# EAGLE design SuperFuzzWah_v1.0 (EAGLE 6.3)
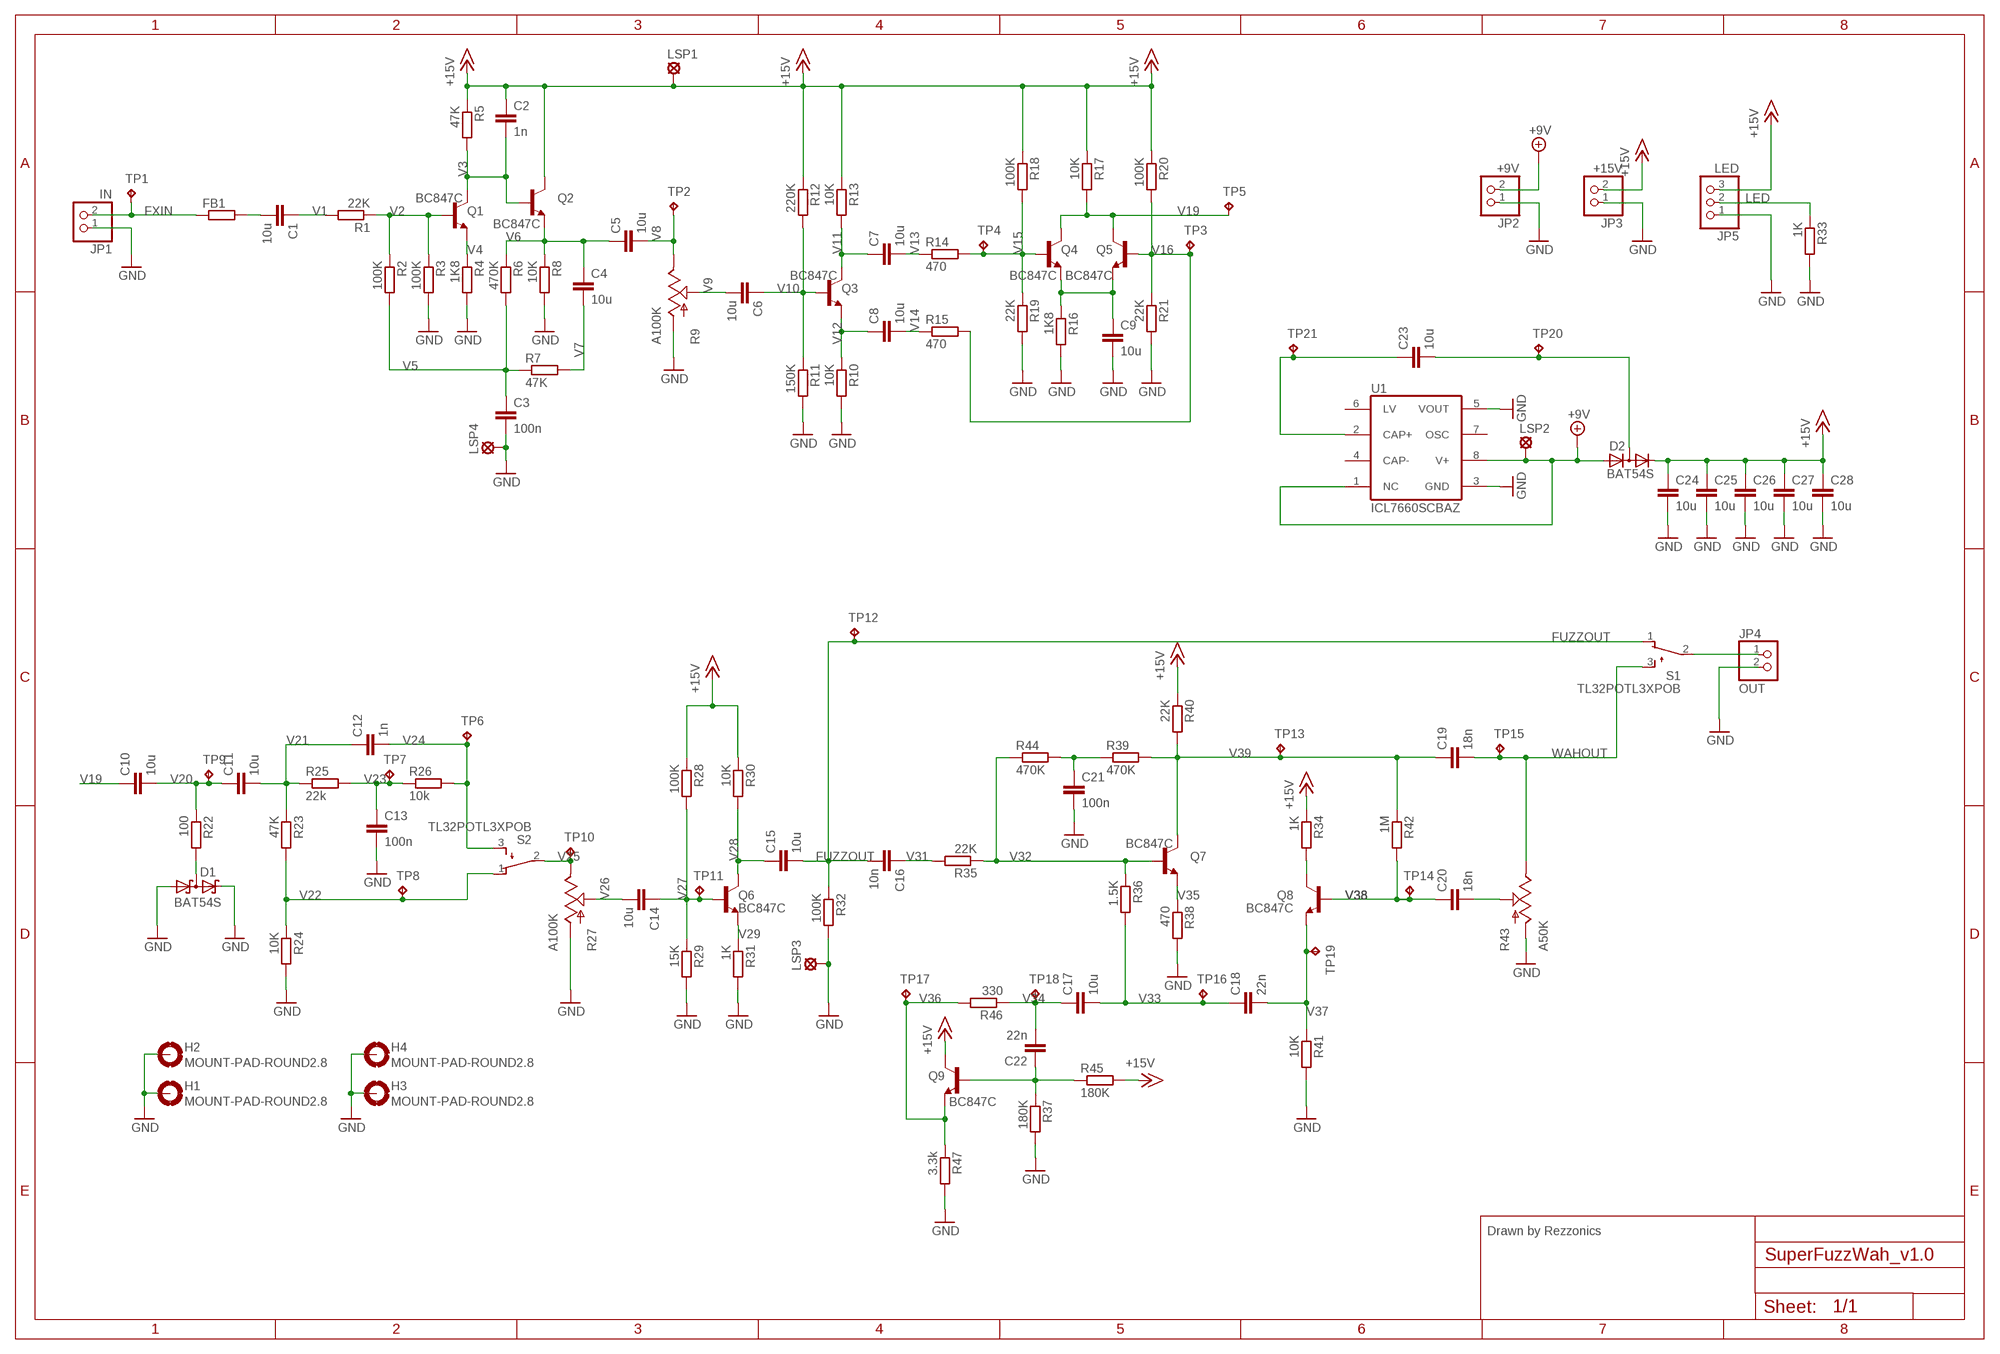
[diagram p0: schematic, sheet 1]

## Parts
C1  10u  C-EUC0805K  [C0805K]
C2  1n  C-EUC0805K  [C0805K]
C3  100n  C-EUC1210K  [C1210K]
C4  10u  C-EUC0805K  [C0805K]
C5  10u  C-EUC0805K  [C0805K]
C6  10u  C-EUC0805K  [C0805K]
C7  10u  C-EUC0805K  [C0805K]
C8  10u  C-EUC0805K  [C0805K]
C9  10u  C-EUC0805K  [C0805K]
C10  10u  C-EUC0805K  [C0805K]
C11  10u  C-EUC0805K  [C0805K]
C12  1n  C-EUC0805K  [C0805K]
C13  100n  C-EUC1210K  [C1210K]
C14  10u  C-EUC0805K  [C0805K]
C15  10u  C-EUC0805K  [C0805K]
C16  10n  C-EUC0603K  [C0603K]
C17  10u  C-EUC0805K  [C0805K]
C18  22n  C-EUC1210K  [C1210K]
C19  18n  C-EUC1210K  [C1210K]
C20  18n  C-EUC1210K  [C1210K]
C21  100n  C-EUC1210K  [C1210K]
C22  22n  C-EUC1210K  [C1210K]
C23  10u  C-EUC0805K  [C0805K]
C24  10u  C-EUC0805K  [C0805K]
C25  10u  C-EUC0805K  [C0805K]
C26  10u  C-EUC0805K  [C0805K]
C27  10u  C-EUC0805K  [C0805K]
C28  10u  C-EUC0805K  [C0805K]
D1  BAT54S  [SOT23]
D2  BAT54S  DIODE_2CACA-SOT23  [SOT23]
FB1  R-EU_R1206  [R1206]
H1  MOUNT-PAD-ROUND2.8  [2,8-PAD]
H2  MOUNT-PAD-ROUND2.8  [2,8-PAD]
H3  MOUNT-PAD-ROUND2.8  [2,8-PAD]
H4  MOUNT-PAD-ROUND2.8  [2,8-PAD]
JP1  IN  PINHD-1X2  [1X02]
JP2  +9V  PINHD-1X2  [1X02]
JP3  +15V  PINHD-1X2  [1X02]
JP4  OUT  PINHD-1X2  [1X02]
JP5  LED  PINHD-1X3  [1X03]
LSP1  LSP13  [LSP13]
LSP2  LSP13  [LSP13]
LSP3  LSP13  [LSP13]
LSP4  LSP13  [LSP13]
Q1  BC847C  BC847C-NPN-SOT23-BEC  [SOT23-BEC]
Q2  BC847C  BC847C-NPN-SOT23-BEC  [SOT23-BEC]
Q3  BC847C  BC847C-NPN-SOT23-BEC  [SOT23-BEC]
Q4  BC847C  BC847C-NPN-SOT23-BEC  [SOT23-BEC]
Q5  BC847C  BC847C-NPN-SOT23-BEC  [SOT23-BEC]
Q6  BC847C  BC847C-NPN-SOT23-BEC  [SOT23-BEC]
Q7  BC847C  BC847C-NPN-SOT23-BEC  [SOT23-BEC]
Q8  BC847C  BC847C-NPN-SOT23-BEC  [SOT23-BEC]
Q9  BC847C  BC847C-NPN-SOT23-BEC  [SOT23-BEC]
R1  22K  R-EU_R0603  [R0603]
R2  100K  R-EU_R0603  [R0603]
R3  100K  R-EU_R0603  [R0603]
R4  1K8  R-EU_R0603  [R0603]
R5  47K  R-EU_R0603  [R0603]
R6  470K  R-EU_R0603  [R0603]
R7  47K  R-EU_R0603  [R0603]
R8  10K  R-EU_R0603  [R0603]
R9  A100K  POT-RV16AF-20  [POT_ALPHA_RV16AF-20]
R10  10K  R-EU_R0603  [R0603]
R11  150K  R-EU_R0603  [R0603]
R12  220K  R-EU_R0603  [R0603]
R13  10K  R-EU_R0603  [R0603]
R14  470  R-EU_R0603  [R0603]
R15  470  R-EU_R0603  [R0603]
R16  1K8  R-EU_R0603  [R0603]
R17  10K  R-EU_R0603  [R0603]
R18  100K  R-EU_R0603  [R0603]
R19  22K  R-EU_R0603  [R0603]
R20  100K  R-EU_R0603  [R0603]
R21  22K  R-EU_R0603  [R0603]
R22  100  R-EU_R0603  [R0603]
R23  47K  R-EU_R0603  [R0603]
R24  10K  R-EU_R0603  [R0603]
R25  22k  R-EU_R0603  [R0603]
R26  10k  R-EU_R0603  [R0603]
R27  A100K  POT-RV16AF-20  [POT_ALPHA_RV16AF-20]
R28  100K  R-EU_R0603  [R0603]
R29  15K  R-EU_R0603  [R0603]
R30  10K  R-EU_R0603  [R0603]
R31  1K  R-EU_R0603  [R0603]
R32  100K  R-EU_R0603  [R0603]
R33  1K  R-EU_R0603  [R0603]
R34  1K  R-EU_R0603  [R0603]
R35  22K  R-EU_R0603  [R0603]
R36  1.5K  R-EU_R0603  [R0603]
R37  180K  R-EU_R0603  [R0603]
R38  470  R-EU_R0603  [R0603]
R39  470K  R-EU_R0603  [R0603]
R40  22K  R-EU_R0603  [R0603]
R41  10K  R-EU_R0603  [R0603]
R42  1M  R-EU_R0603  [R0603]
R43  A50K  POT-RV16AF-20  [POT_ALPHA_RV16AF-20]
R44  470K  R-EU_R0603  [R0603]
R45  180K  R-EU_R0603  [R0603]
R46  330  R-EU_R0603  [R0603]
R47  3.3k  R-EU_R0603  [R0603]
S1  TL32POTL3XPOB  [TL3XPOB]
S2  TL32POTL3XPOB  [TL3XPOB]
TP1  TPTP10R  [TP10R]
TP2  TPTP10R  [TP10R]
TP3  TPTP10R  [TP10R]
TP4  TPTP10R  [TP10R]
TP5  TPTP10R  [TP10R]
TP6  TPTP10R  [TP10R]
TP7  TPTP10R  [TP10R]
TP8  TPTP10R  [TP10R]
TP9  TPTP10R  [TP10R]
TP10  TPTP10R  [TP10R]
TP11  TPTP10R  [TP10R]
TP12  TPTP10R  [TP10R]
TP13  TPTP10R  [TP10R]
TP14  TPTP10R  [TP10R]
TP15  TPTP10R  [TP10R]
TP16  TPTP10R  [TP10R]
TP17  TPTP10R  [TP10R]
TP18  TPTP10R  [TP10R]
TP19  TPTP10R  [TP10R]
TP20  TPTP10R  [TP10R]
TP21  TPTP10R  [TP10R]
U1  ICL7660SCBAZ  ICL7660CSA  [SO08]

## Nets
+9V: D2.1(A) JP2.2 LSP2.MP U1.1(NC) U1.8(V+)
+15V: C2.1 C24.1 C25.1 C26.1 C27.1 C28.1 D2.2(C) JP3.2 JP5.3 LSP1.MP Q2.C Q9.C R5.1 R12.1 R13.1 R17.1 R18.1 R20.1 R28.1 R30.1 R34.1 R40.1 R45.2
FUZZOUT: C15.2 C16.2 R32.1 S1.1(O) TP12.TP
FXIN: FB1.1 JP1.2 TP1.TP
GND: C3.2 C9.2 C13.2 C21.2 C24.2 C25.2 C26.2 C27.2 C28.2 D1.1(A1) D1.2(C2) H1.B2,8(MOUNT) H2.B2,8(MOUNT) H3.B2,8(MOUNT) H4.B2,8(MOUNT) JP1.1 JP2.1 JP3.1 JP4.2 JP5.1 LSP3.MP LSP4.MP R3.2 R4.2 R8.2 R9.1(A) R10.2 R11.2 R16.2 R19.2 R21.2 R24.2 R27.1(A) R29.2 R31.2 R32.2 R33.2 R37.2 R38.2 R41.2 R43.1(A) R47.2 U1.3(GND) U1.5(VOUT)
LED: JP5.2 R33.1
N$1: D1.3(C1A2) R22.2
N$2: C20.2 R43.2(S)
N$3: C21.1 R39.1 R44.2
N$4: Q8.C R34.2
N$5: JP4.1 S1.2(P)
N$6: C22.1 Q9.B R37.1 R45.1
N$7: C1.2 FB1.2
N$8: C23.1 TP21.TP U1.2(CAP+)
N$10: C23.2 D2.3(AC) TP20.TP
N$19: C9.1 Q4.E Q5.E R16.1
V1: C1.1 R1.2
V2: Q1.B R1.1 R2.1 R3.1
V3: C2.2 Q1.C Q2.B R5.2
V4: Q1.E R4.1
V5: C3.1 R2.2 R6.2 R7.1
V6: C4.1 C5.1 Q2.E R6.1 R8.1
V7: C4.2 R7.2
V8: C5.2 R9.3(E) TP2.TP
V9: C6.2 R9.2(S)
V10: C6.1 Q3.B R11.1 R12.2
V11: C7.1 Q3.C R13.2
V12: C8.1 Q3.E R10.1
V13: C7.2 R14.1
V14: C8.2 R15.1
V15: Q4.B R14.2 R18.2 R19.1 TP4.TP
V16: Q5.B R15.2 R20.2 R21.1 TP3.TP
V19: C10.1 Q4.C Q5.C R17.2 TP5.TP
V20: C10.2 C11.1 R22.1 TP9.TP
V21: C11.2 C12.1 R23.1 R25.1
V22: R23.2 R24.1 S2.1(O) TP8.TP
V23: C13.1 R25.2 R26.1 TP7.TP
V24: C12.2 R26.2 S2.3(S) TP6.TP
V25: R27.3(E) S2.2(P) TP10.TP
V26: C14.2 R27.2(S)
V27: C14.1 Q6.B R28.2 R29.1 TP11.TP
V28: C15.1 Q6.C R30.2
V29: Q6.E R31.1
V31: C16.1 R35.2
V32: Q7.B R35.1 R36.1 R44.1
V33: C17.2 C18.1 R36.2 TP16.TP
V34: C17.1 C22.2 R46.1 TP18.TP
V35: Q7.E R38.1
V36: Q9.E R46.2 R47.1 TP17.TP
V37: C18.2 Q8.E R41.1 TP19.TP
V38: C20.1 Q8.B R42.2 TP14.TP
V39: C19.1 Q7.C R39.2 R40.2 R42.1 TP13.TP
WAHOUT: C19.2 R43.3(E) S1.3(S) TP15.TP
Unconnected: U1.4(CAP-) U1.6(LV) U1.7(OSC)

## Notes on the sheet
- Drawn by Rezzonics

## Library data of the parts
C1 C4-C11 C14 C15 C17 C23-C28 = rcl:C-EU: CAPACITOR, European symbol; MPN: GRM21BR61E106KA73L
C2 C12 = rcl:C-EU: CAPACITOR, European symbol; MPN: GRM1885C1H102FA01D
C3 C13 C21 = rcl:C-EU: CAPACITOR, European symbol; MPN: CB027D0104JBA
C16 = rcl:C-EU: CAPACITOR, European symbol; MPN: ESD35C103K4T2A-18
C18 C22 = rcl:C-EU: CAPACITOR, European symbol; MPN: ECH-U1H223JX5
C19 C20 = rcl:C-EU: CAPACITOR, European symbol; MPN: ECH-U1H183GX5
D1 = diode:BAT54S: Schottky Diodes Pin connection corrected 2011-05-04 Source: Fairchild .. BAT54.pdf; MPN: BAT54S
D2 = diode:DIODE_2CACA-: 2 Diodes - Cathode-Anode|Cathode-Anode; MPN: BAT54S
FB1 = rcl:R-EU_: RESISTOR, European symbol; MPN: BLM31PG121SN1L
H1-H4 = holes:MOUNT-PAD-ROUND: MOUNTING PAD, round; MPN: *
JP1-JP4 = pinhead:PINHD-1X2: PIN HEADER; MPN: 77311-401-36LF
JP5 = pinhead:PINHD-1X3: PIN HEADER; MPN: 77311-401-36LF
LSP1-LSP4 = solpad:LSP13: SOLDER PAD drill 1.3 mm, distributor Buerklin, 12H562; MPN: 1249
Q1-Q9 = transistor-neu-to92:*-NPN-: NPN Transistror; MPN: BC847C,215
R1 R19 R21 R25 R35 R40 = resistor:R-EU_: RESISTOR, European symbol; MPN: ERJ-3EKF2202V
R2 R3 R18 R20 R28 R32 = resistor:R-EU_: RESISTOR, European symbol; MPN: CR0603-FX-1003ELF
R4 R16 = resistor:R-EU_: RESISTOR, European symbol; MPN: ERJ-3EKF1801V
R5 R7 R23 = resistor:R-EU_: RESISTOR, European symbol; MPN: RK73H1JTTD4702F
R6 R39 R44 = resistor:R-EU_: RESISTOR, European symbol; MPN: ERJ-3EKF4703V
R8 R10 R13 R17 R24 R26 R30 R41 = resistor:R-EU_: RESISTOR, European symbol; MPN: CR0603-FX-1002HLF
R9 R27 = SparkFun:POT; MPN: RV16AF-10-20R1-A100K
R11 = resistor:R-EU_: RESISTOR, European symbol; MPN: CRCW0603150KFKEB
R12 = resistor:R-EU_: RESISTOR, European symbol; MPN: ERJ-3EKF2203V
R14 R15 R38 = resistor:R-EU_: RESISTOR, European symbol; MPN: CR0603-FX-4700ELF
R22 = resistor:R-EU_: RESISTOR, European symbol; MPN: CR0201-FW-1000GLF
R29 = resistor:R-EU_: RESISTOR, European symbol; MPN: RK73H1HTTC1502F
R31 R33 R34 = resistor:R-EU_: RESISTOR, European symbol; MPN: CR0603-FX-1001HLF
R36 = resistor:R-EU_: RESISTOR, European symbol; MPN: ERJ-3EKF1501V
R37 R45 = resistor:R-EU_: RESISTOR, European symbol; MPN: CR0603-FX-1803ELF
R42 = resistor:R-EU_: RESISTOR, European symbol; MPN: CR0603-FX-1004ELF
R43 = SparkFun:POT; MPN: RV16AF-10-20R1-A50K
R46 = resistor:R-EU_: RESISTOR, European symbol; MPN: ERJ-3EKF3300V
R47 = resistor:R-EU_: RESISTOR, European symbol; MPN: RK73H1JTTDD3321F
S1 S2 = switch:TL32PO: TINY SWITCH ON - MOM Source: http://www2.produktinfo.conrad.com/datenblaetter/700000-724999/705152-da-01-de-Subminiaturschalter_TL_36YO.pdf; MPN: M2012SS1W01
TP1-TP21 = testpad:TP: Test pad; MPN: *
U1 = maxim:ICL7660CSA: VOLTAGE CONVERTER; MF: MAXIM; MPN: ICL7660SCBAZ; OC_FARNELL: 9724710; OC_NEWARK: 34C3732

## Board
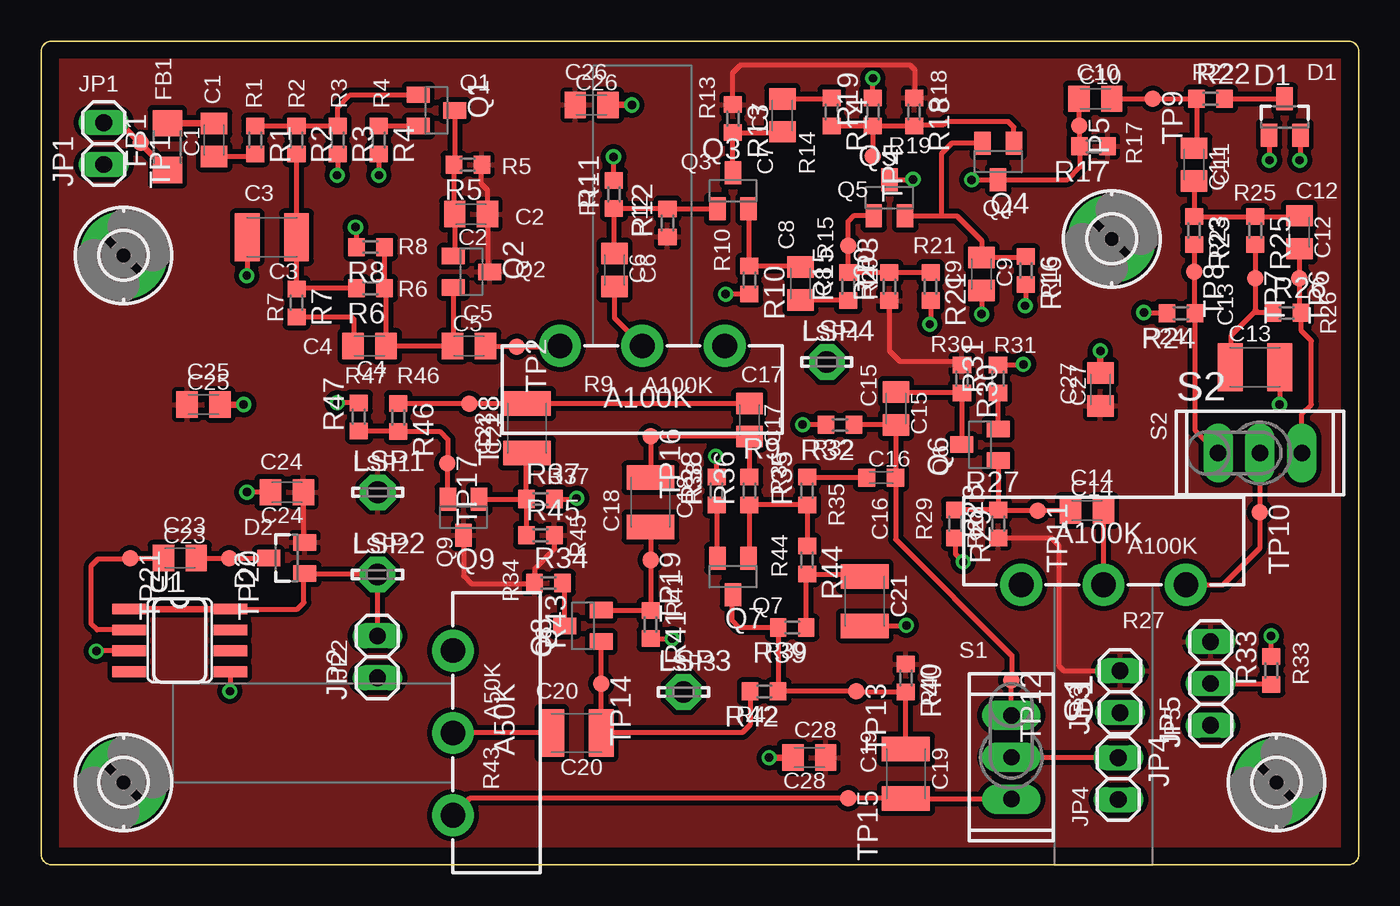
[diagram p1: board, top side]
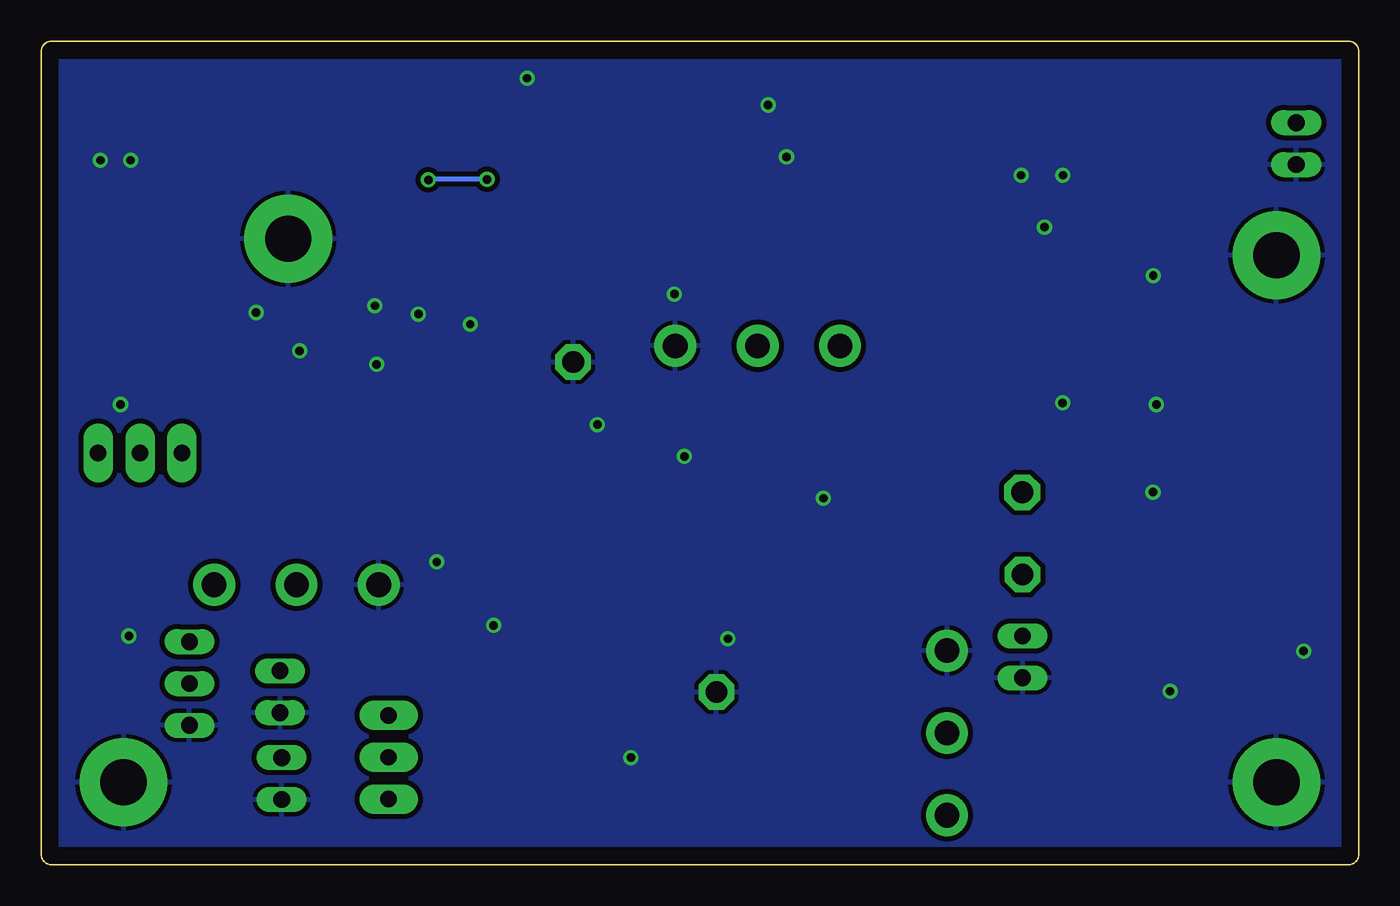
[diagram p2: board, bottom side, seen from below]

Size 80 x 50 mm. Coordinates in mm from the lower left corner, seen from the top.
Outline: 0,49.37 0,0.64 arc90 0.64,0 79.36,0 arc90 80,0.64 80,49.37 arc90 79.36,50 0.64,50 arc90 0,49.37
Copper layers (1*16): Top 0.035mm / dielectric 1.5mm / Bottom 0.035mm
Design rules "default *": minimum track width 10mil, minimum drill 19mil, track to track 8mil, track to pad 8mil, pad to pad 8mil, via to via 8mil, smd to smd 8mil, copper to edge 40mil, drill to drill 8mil, minimum pad ring 10mil, minimum via ring 8mil, stop-mask expansion 4mil, vias tented up to drill 0mil, thermal gap 10mil

### Footprints (pad centres in the part's own frame; a part is rotated, then mirrored left to right if it is on the bottom)
C0805K = smd 1.3 x 1.6: 1 -1,0; 2 1,0
C1210K = smd 1.5 x 2.9: 1 -1.5,0; 2 1.5,0
C0603K = smd 1.05 x 1.08: 1 -0.875,0; 2 0.875,0
SOT23 = smd 1 x 1.4: 1 -0.95,-1.1; 2 0.95,-1.1; 3 0,1.1
R1206 = smd 1.6 x 1.803: 1 -1.422,0; 2 1.422,0
2,8-PAD = drill 2.8 pad 5.334: B2,8 0,0
1X02 = drill 1.016 long: 1 -1.27,0; 2 1.27,0
1X03 = drill 1.016 long: 1 -2.54,0; 2 0,0; 3 2.54,0
LSP13 = drill 1.321 pad 2.159 octagon: MP 0,0
SOT23-BEC = smd 1 x 1.4: B -0.95,-1.1; C 0,1.1; E 0.95,-1.1
R0603 = smd 1 x 1.1: 1 -0.85,0; 2 0.85,0
POT_ALPHA_RV16AF-20 = drill 1.5 pad 2.54: 1 -5,0; 2 0,0; 3 5,0
TL3XPOB = drill 1 pad 1.778 long: 1 -2.54,0; 2 0,0; 3 2.54,0
TP10R = smd 1 x 1: TP 0,0
SO08 = smd 0.66 x 2.032: 1 -1.905,-3.073; 2 -0.635,-3.073; 3 0.635,-3.073; 4 1.905,-3.073; 5 1.905,3.073; 6 0.635,3.073; 7 -0.635,3.073; 8 -1.905,3.073

### Placement (x,y rotation side)
C1  10.5,44 90 top
C2  26.11,39.5 180 top
C3  14.01,38.1 180 top
C4  19.94,31.49 180 top
C5  25.98,31.49 0 top
C6  34.8,36.1 270 top
C7  45,45.5 90 top
C8  46.1,35.3 270 top
C9  57.09,35.87 270 top
C10  64,46.5 0 top
C11  70,42.5 270 top
C12  76.39,38.4 270 top
C13  73.7,30.2 0 top
C14  63.5,21.5 0 top
C15  51.9,27.7 270 top
C16  51,23.5 0 top
C17  43,27 270 top
C18  37,22 270 top
C19  52.5,5.52 270 top
C20  32.5,8 180 top
C21  50,16 270 top
C22  29.5,26.5 90 top
C23  8.41,18.62 0 top
C24  14.91,22.62 180 top
C25  9.86,27.94 0 top
C26  33.43,46.13 0 top
C27  64.31,28.85 90 top
C28  46.63,6.5 180 top
D1  75.5,45.4 0 top
D2  14.91,18.62 90 top
FB1  7.66,43.59 90 top
H1  5,5 0 top
H2  75,5 0 top
H3  5,37 0 top
H4  65,38 0 top
JP1  3.8,43.78 90 top
JP2  20.41,12.62 90 top
JP3  65.5,10.5 90 top
JP4  65.4,5.23 270 top
JP5  71,11 90 top
LSP1  20.44,22.61 0 top
LSP2  20.41,17.62 0 top
LSP3  39,10.48 0 top
LSP4  47.7,30.52 0 top
Q1  24,45.8 270 top
Q2  26.13,36 270 top
Q3  42,40.92 0 top
Q4  58.1,42.7 180 top
Q5  51.5,40.5 0 top
Q6  57,25.5 90 top
Q7  42,17.5 180 top
Q8  32.9,14.5 90 top
Q9  25.64,21.1 180 top
R1  13,44 270 top
R2  15.5,44 270 top
R3  18,44 270 top
R4  20.5,44 270 top
R5  25.91,42.5 180 top
R6  20,35 180 top
R7  15.51,34.12 270 top
R8  20,37.5 180 top
R9  36.5,31.5 180 top
R10  43,35.5 270 top
R11  34.77,40.7 90 top
R12  38.02,38.96 90 top
R13  42,45.3 270 top
R14  48,45.7 270 top
R15  49,35.09 90 top
R16  59.79,36.08 270 top
R17  63.9,43.61 180 top
R18  53,45.7 270 top
R19  50.5,45.7 90 top
R20  51.5,35.09 90 top
R21  54,35.09 270 top
R22  71,46.5 0 top
R23  70,38.5 270 top
R24  69.2,33.48 180 top
R25  73.71,38.5 270 top
R26  75.63,33.5 0 top
R27  64.5,17 0 top
R28  58.1,20.7 90 top
R29  55.5,20.7 270 top
R30  55.91,29.5 270 top
R31  58.09,29.5 90 top
R32  48.5,26.7 180 top
R33  74.69,11.8 90 top
R34  30.8,17.1 0 top
R35  46.5,22.7 90 top
R36  43,22.7 90 top
R37  30.31,22.2 0 top
R38  41.01,22.7 90 top
R39  45.6,14.4 180 top
R40  52.5,11.33 270 top
R41  37,14.58 270 top
R42  43.9,10.52 180 top
R43  25,8 270 top
R44  46.5,18.5 270 top
R45  30.31,20 0 top
R46  21.68,27.16 270 top
R47  19.29,27.2 90 top
S1  58.9,6.52 270 top
S2  74,25 0 top
TP1  6.03,43.83 270 top
TP2  28.87,31.45 270 top
TP3  49,37.59 270 top
TP4  50.5,43 270 top
TP5  63.04,44.87 270 top
TP6  76.39,35.6 270 top
TP7  73.71,35.6 270 top
TP8  70,36 270 top
TP9  67.5,46.5 270 top
TP10  73.97,21.41 270 top
TP11  60.5,21.5 270 top
TP12  58.9,11.2 270 top
TP13  49.5,10.52 270 top
TP14  34,11 270 top
TP15  49,4.02 270 top
TP16  37,26 270 top
TP17  24.67,24.37 270 top
TP18  26,28 270 top
TP19  37,18.5 270 top
TP20  11.41,18.62 270 top
TP21  5.41,18.62 270 top
U1  8.41,13.62 270 top

### Tracks (layer width: path | path; a pad name or v marks a point on that pad's centre or on a via)
+9V
  Top 0.305: U1.8 15.55,15.52 15.95,15.92 15.95,17.6 D2.1 20.36,17.67 LSP2.MP JP2.2
  Top 0.406: U1.1 U1.8
+15V
  Top 0.305: R5.1 26.72,42.46 26.72,41.35 27.11,40.96 C2.1 27.11,36.12 Q2.C | C24.1 15.91,19.67 D2.2 | R45.2 31.16,19.17 29.97,17.98 29.97,17.12 R34.1 29.92,17.07 26.11,17.07 25.64,17.54 Q9.C 25.55,19.91 | R20.1 51.5,31.2 52.12,30.58 55.67,30.58 | R13.1 42,48.1 42.47,48.56 52.73,48.56 53.03,48.26 53.03,46.59 R18.1 | R28.1 61.33,19.84 61.77,19.41 61.77,12.09 62.08,11.79 65.48,11.79
  pour Top (isolate 0.305): 0,49.35 0,0.64 arc90 0.64,0 79.32,0 arc90 79.96,0.64 79.96,49.35 arc90 79.32,49.99 0.64,49.99 arc90
FUZZOUT
  Top 0.305: R32.1 C15.2 51.9,23.52 C16.2 51.88,19.75 58.93,12.7 58.93,11.23 TP12.TP S1.1
FXIN
  Top 0.406: JP1.2 4.78,45.05 5.21,44.63 6,43.83 | 6,43.83 FB1.1 | TP1.TP 6,43.83
GND  (via drill 0.51)
  Top 0.305: C24.2 v12.5,22.62 | U1.3 3.36,12.98 v3.35,12.97 | U1.5 11.49,10.57 v11.46,10.53 | R37.2 32.47,22.2 v32.51,22.25 | R38.2 41.01,24.73 v40.95,24.79 | R10.2 v41.56,34.65 v41.55,34.65 | R32.2 46.25,26.7 v46.23,26.72 | R11.2 34.77,42.95 v34.75,42.98 | R19.2 v50.5,47.75 v50.49,47.75 | R21.2 54,32.87 v53.95,32.82 | C9.2 v57.09,33.43 v57.1,33.43 | R16.2 59.79,33.98 v59.74,33.93 | R31.2 59.61,30.35 v59.64,30.38 | R29.2 55.5,18.87 v55.98,18.39 | C21.2 52.5,14.5 v52.53,14.53 | R24.2 67,33.48 v66.95,33.53 | C13.2 75.19,27.95 v75.18,27.94 | D1.1 74.55,42.8 v74.57,42.77 | D1.2 76.45,42.82 v76.4,42.77 | R3.2 18,41.89 v17.97,41.86 | R4.2 v20.5,41.87 v20.51,41.86 | C3.2 12.51,35.79 v12.48,35.76 | R8.2 19.15,38.64 v19.09,38.71 | R47.2 v17.99,28.05 v17.98,28.04 | R33.2 74.69,13.88 v74.68,13.89 | R41.2 v38.29,13.73 v38.3,13.72
  Top 0.406: C25.2 v12.29,27.94 | C26.2 v35.87,46.13 | C28.2 v44.2,6.5 | C27.2 v64.31,31.19
  pour Bottom (isolate 0.305): 79.32,49.99 0.64,49.99 arc90 0,49.35 0,0.64 arc90 0.64,0 79.32,0 arc90 79.96,0.64 79.96,49.35 arc90
LED
  Top 0.305: JP5.2 74.63,11 R33.1
N$1
  Top 0.305: R22.2 D1.3
N$2
  Top 0.305: C20.2 R43.2
N$3
  Top 0.305: R39.1 46.45,17.6 R44.2 49.85,17.65 C21.1
N$4
  Top 0.305: Q8.C 31.8,16.96 R34.2
N$5
  Top 0.305: JP4.1 58.92,6.5 S1.2
N$6
  Top 0.305: Q9.B R37.1 | R37.1 29.46,24.96 C22.1 | R37.1 R45.1
N$7
  Top 0.406: FB1.2 10.49,45.01 C1.2
N$8
  Top 0.305: U1.2 3.39,14.25 3.05,14.6 3.05,18.15 3.45,18.56 5.36,18.56 TP21.TP C23.1
N$10
  Top 0.305: C23.2 TP20.TP D2.3
N$19
  Top 0.305: Q5.E 54.76,39.4 | 54.76,39.4 55.6,39.4 57.1,37.9 C9.1 59.74,36.87 R16.1 | Q4.E 55.28,43.8 54.66,43.18 54.66,39.5 54.76,39.4
V1
  Top 0.305: C1.1 12.85,43 R1.2
V2
  Top 0.305: R1.1 R2.1 R3.1 18,45.96 18.78,46.74 22.89,46.74 Q1.B
V3
  Top 0.305: Q1.C 25.1,42.54 R5.2 25.06,39.55 C2.2 25.11,37.03 Q2.B
V4
  Top 0.305: R4.1 Q1.E
V5
  Top 0.305: R2.2 C3.1 R7.1 15.54,35 R6.2
V6
  Top 0.305: Q2.E 25.03,31.53 C5.1 C4.1 20.94,34.91 R6.1 R8.1
V7
  Top 0.305: C4.2 18.98,31.53 18.98,33.12 18.84,33.27 R7.2
V8
  Top 0.305: C5.2 28.83,31.49 TP2.TP 31.45,31.45 R9.3
V9
  Top 0.305: C6.2 34.8,33.2 R9.2
V10
  Top 0.305: C6.1 34.8,39.82 R11.1 37.98,39.85 R12.2 Q3.B
V11
  Top 0.305: Q3.C R13.2 44.95,44.45 C7.1
V12
  Top 0.305: Q3.E 42.95,36.4 R10.1 46.05,36.35 C8.1
V13
  Top 0.305: C7.2 47.95,46.5 R14.1
V14
  Top 0.305: C8.2 48.95,34.3 R15.1
V15
  Top 0.305: R14.2 R19.1 | R19.1 TP4.TP | R19.1 R18.2 53.05,44.91 54.76,44.91 54.97,45.11 58.73,45.11 59.05,44.78 Q4.B
V16
  Top 0.305: R21.1 R20.2 R15.2 TP3.TP 49,39.04 49.38,39.42 50.53,39.42 Q5.B
V19  (via drill 0.51)
  Top 0.305: Q5.C v52.93,41.6 | v56.49,41.58 58.09,41.58 Q4.C 62.32,41.59 63.09,42.37 63.09,43.56 R17.2 TP5.TP 63.04,46.46 C10.1
  Bottom 0.305: v52.93,41.6 56.46,41.6 v56.49,41.58
V20
  Top 0.305: C10.2 TP9.TP R22.1 70.15,43.65 C11.1
V21
  Top 0.305: C11.2 R23.1 R25.1 76.34,39.35 C12.1
V22
  Top 0.305: R23.2 TP8.TP 70,33.54 R24.1 70.05,26.41 S2.1
V23
  Top 0.305: R25.2 TP7.TP 73.71,33.68 73.86,33.53 74.75,33.53 R26.1 73.63,33.5 72.24,32.11 72.24,30.25 C13.1
V24
  Top 0.305: C12.2 TP6.TP 76.39,33.59 R26.2 | S2.3 76.54,27.37 77.11,27.94 77.11,31.8 76.5,32.41 76.5,33.47 R26.2 | 76.5,33.53 R26.2
V25
  Top 0.305: S2.2 74,21.44 TP10.TP 73.97,19.21 71.73,16.97 69.53,16.97 R27.3
V26
  Top 0.305: R27.2 C14.2
V27
  Top 0.305: C14.1 TP11.TP 58.15,21.5 R28.2 | R28.2 R29.1 | Q6.B R28.2
V28
  Top 0.305: Q6.C R30.2 51.95,28.65 C15.1
V29
  Top 0.305: Q6.E R31.1
V31
  Top 0.305: C16.1 46.55,23.5 R35.2
V32
  Top 0.305: Q7.B 43,18.65 R36.1 R35.1 R44.1
V33
  Top 0.305: R36.2 C17.2 TP16.TP C18.1
V34
  Top 0.305: C17.1 C22.2 TP18.TP R46.1
V35
  Top 0.305: R38.1 41.01,18.64 Q7.E
V36
  Top 0.305: R47.1 21.64,26.35 R46.2 24.19,26.31 24.69,25.81 24.69,24.39 TP17.TP 24.67,22.23 Q9.E
V37
  Top 0.305: C18.2 TP19.TP R41.1 36.98,15.45 Q8.E
V38
  Top 0.305: Q8.B TP14.TP C20.1 34.03,8.03 42.57,8.03 43.05,8.5 R42.2
V39
  Top 0.305: R39.2 | R39.2 42.4,14.4 41.96,14.83 41.96,16.36 Q7.C | C19.1 R40.2 49.55,10.48 TP13.TP R42.1 R39.2
WAHOUT
  Top 0.305: S1.3 52.54,3.98 C19.2 TP15.TP 26.02,4.02 R43.3

### Text on the board
_tsilk: C26 | R18 | C10 | R22 | D1 | JP1 | Q1 | FB1 | C1 | R1 | R2 | R3 | R4 | R13 | C11 | R19 | R17 | R5 | Q3 | C7 | R14 | C3 | Q5 | R25 | C12 | C2 | R11 | Q4 | R23 | R12 | R8 | C6 | C8 | R15 | R21 | R16 | Q2 | R10 | C9 | R6 | R20 | R7 | C5 | R24 | C13 | LSP4 | R26 | C4 | R30 | R31 | R9 | A100K | C25 | R47 | R46 | C17 | C15 | C27 | R32 | S2 | C22 | C24 | LSP1 | Q6 | R37 | C14 | R38 | R36 | R35 | C23 | D2 | Q9 | C18 | C16 | R29 | LSP2 | R45 | R28 | A100K | C21 | U1 | R44 | R34 | R41 | Q7 | R39 | R27 | Q8 | S1 | A50K | LSP3 | R40 | JP2 | R33 | C20 | R42 | JP3 | C28 | JP5 | C19 | R43 | JP4